# Altium schematic sheet ZW Radio.SchDoc
size A; SheetNumber: 6; SheetTotal: 6
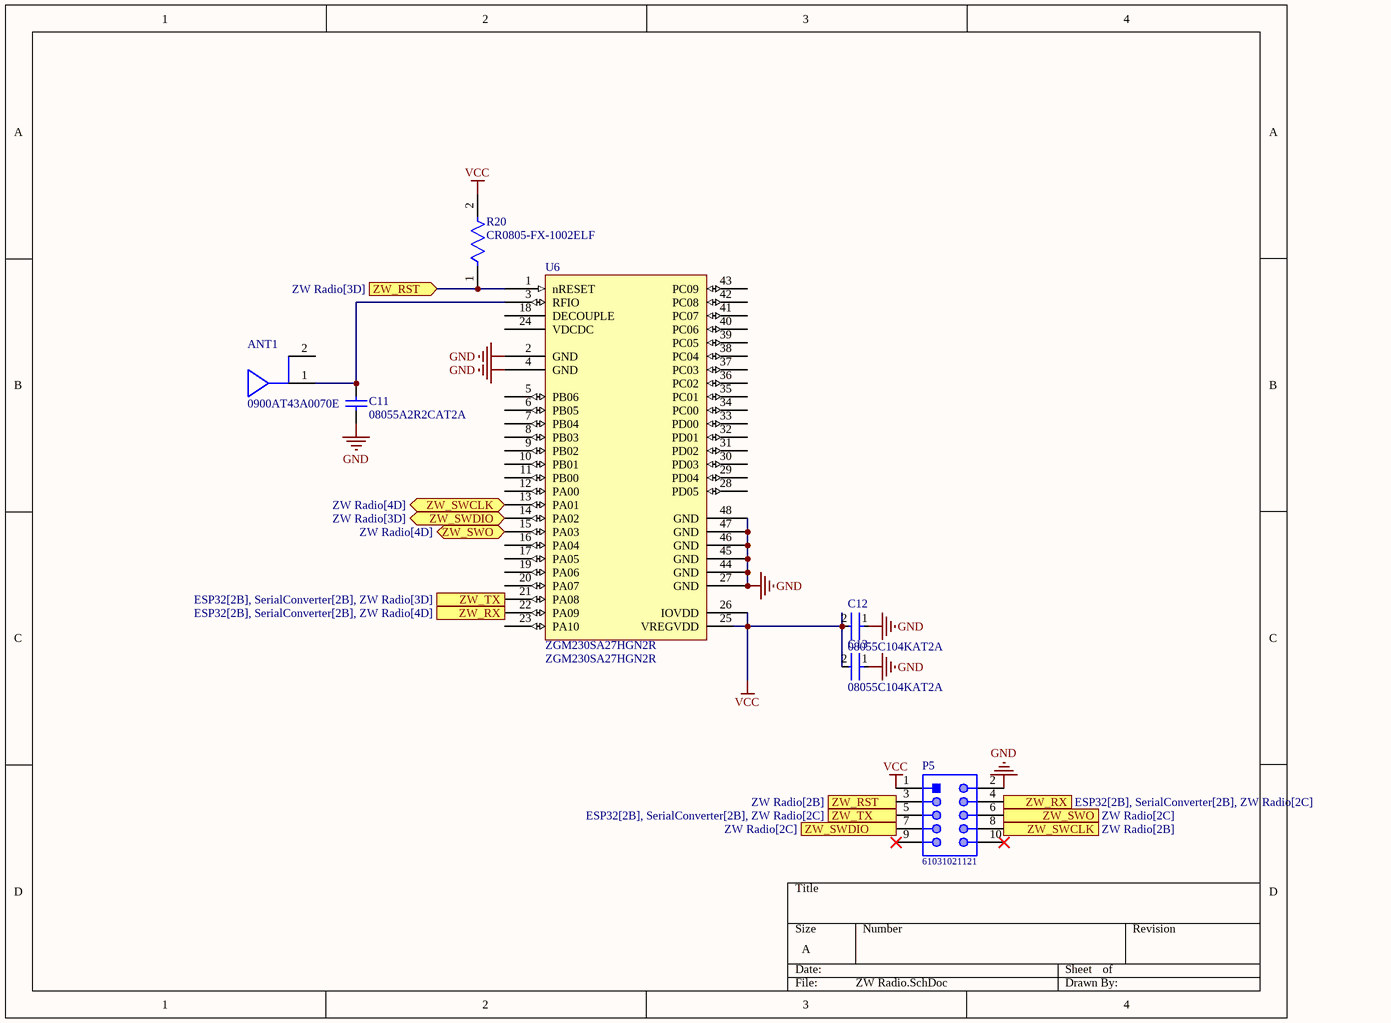
[diagram p0: ZW Radio.SchDoc]

## Parts
ANT1  0900AT43A0070E  [FP-0900AT43A0070E-MFG]
C11  08055A2R2CAT2A  [CAPC2013X94X50NL20T25]
C12  08055C104KAT2A  [FP-0805-L_2_01_0_2-W_1_25-IPC_C]
C13  08055C104KAT2A  [FP-0805-L_2_01_0_2-W_1_25-IPC_C]
P5  61031021121  [61031021121]
R20  CR0805-FX-1002ELF  [FP-CR0805-IPC_A]
U6  ZGM230SA27HGN2R  [QFN50P650X650X128_HS-45N]

## Ports
ZW_RST (in, see ZW Radio[2B]), ZW_RST (in, see ZW Radio[3D]), ZW_RX (in, see ESP32[2B], SerialConverter[2B], ZW Radio[4D]), ZW_RX (out, see ESP32[2B], SerialConverter[2B], ZW Radio[2C]), ZW_SWCLK (bidir, see ZW Radio[4D]), ZW_SWCLK (see ZW Radio[2B]), ZW_SWDIO (bidir, see ZW Radio[3D]), ZW_SWDIO (see ZW Radio[2C]), ZW_SWO (bidir, see ZW Radio[4D]), ZW_SWO (see ZW Radio[2C]), ZW_TX (in, see ESP32[2B], SerialConverter[2B], ZW Radio[2C]), ZW_TX (out, see ESP32[2B], SerialConverter[2B], ZW Radio[3D])

## Nets
GND: C11.1 C12.1 C13.1 P5.2 U6.2(GND) U6.4(GND) U6.27(GND) U6.44(GND) U6.45(GND) U6.46(GND) U6.47(GND) U6.48(GND)
VCC: C12.2 C13.2 P5.1 R20.2 U6.25(VREGVDD) U6.26(IOVDD)
ZW_RST: P5.3 R20.1 U6.1(nRESET) ; port ZW_RST
ZW_RX: P5.4 U6.22(PA09) ; port ZW_RX
ZW_SWCLK: P5.8 U6.13(PA01) ; port ZW_SWCLK
ZW_SWDIO: P5.7 U6.14(PA02) ; port ZW_SWDIO
ZW_SWO: P5.6 U6.15(PA03) ; port ZW_SWO
ZW_TX: P5.5 U6.21(PA08) ; port ZW_TX
NetANT1_1: ANT1.1(RF_Feeding_Point) C11.2 U6.3(RFIO)

Not connected (* = marked no-connect by the designer): ANT1 2(To_trace_element); P5 9* 10*; U6 5(PB06) 6(PB05) 7(PB04) 8(PB03) 9(PB02) 10(PB01) 11(PB00) 12(PA00) 16(PA04) 17(PA05) 18(DECOUPLE) 19(PA06) 20(PA07) 23(PA10) 24(VDCDC) 28(PD05) 29(PD04) 30(PD03) 31(PD02) 32(PD01) 33(PD00) 34(PC00) 35(PC01) 36(PC02) 37(PC03) 38(PC04) 39(PC05) 40(PC06) 41(PC07) 42(PC08) 43(PC09)

## Library data of the parts
ANT1 = CMP-56579-000002-1: RF ANT CHIP SOLDER SMD; Impedance: 50R; Max Frequency: 928MHz; Number of Pins: 2; Mount: Surface Mount; RoHS Compliant: No; Contact Plating: Tin
C11 = CMP-1036-00283-2: Manufacturer: AVX Interconnect / Elco; Part Number: 08055A2R2CAT2A
C12 C13 = CMP-2000-05016-2: General Purpose Ceramic Capacitor, 0805, 100nF, 10%, X7R, 0.15, 50V; Dissipation Factor: 2.5%; Insulation Resistance: 100GR; Voltage Rating (DC): 50V; Package Quantity: 4000; Tolerance: 10%; Voltage Rating: 50V; Dielectric: X7R; Case/Package: 0805; Lead Free: Lead Free; Dielectric Material: Ceramic; Thickness: 0.037inch; Weight: 0.001411oz; Max Operating Temperature: 125°C; REACH SVHC: No SVHC; Mount: Surface Mount; RoHS Compliant: Yes; Depth: 1.25mm; Height: 0.5mm; Case Code (Metric): 2012; Length: 2mm; Termination: Standard; Case Code (Imperial): 0805; Number of Pins: 2; Voltage: 50V; Radiation Hardening: No; Min Operating Temperature: -55°C; Capacitance: 100nF; Width: 1.2mm; Series: MLCC X7R; Packaging: Cut Tape
P5 = CMP-1502-01053-1: SMT Vertical Pin Header WR-PHD, Pitch 2.54 mm, Dual Row, 10 pins; Manufacturer: Wurth Elektronik; Gender: Male; Rated Current: 3A; Working Voltage: 250VAC; Withstanding Voltage: 500VAC; Pitch: 2.54mm; Pin Number: 10; Contact Resistance: 20mOhm; Packaging: TapeandReel; Part Number: 61031021121; Mounting Technology: SMT; Package Reference: 61031021121; Operating Temperature: -40to125degC; Manufacturer URL: http://www.we-online.de; Publisher: WurthElektronik; Datasheet URL: https://katalog.we-online.de/em/datasheet/6103xx21121.pdf; Orientation: Vertical; Row Number: Dual
R20 = CMP-07231-003204-1: Thick Film Chip Resistors 0805 10kΩ 0.125W 1% 100ppm/°C; Max Power Dissipation: 125mW; Voltage Rating: 150V; Voltage Rating (DC): 100V; Resistance: 10kR; Height: 0.5mm; Tolerance: 1%; Max Operating Temperature: 155°C; Thickness: 508um; Radiation Hardening: No; Packaging: Tape and Reel; Depth: 1.25mm; Contact Plating: Tin; Package Quantity: 1; Case Code (Metric): 2012; REACH SVHC: No SVHC; Min Operating Temperature: -55°C; Power Rating: 125mW; Mount: Surface Mount; Length: 2mm; Case Code (Imperial): 0805; Width: 1.25mm; Temperature Coefficient: 100ppm/°C; Termination: SMD/SMT; Composition: Thick Film; Features: Moisture Resistant; Case/Package: 0805; Number of Terminations: 2
U6 = CMP-021-00007-1: ZGM230S Z-wave Sip, Secure Vault; Power: 3.3W; Pins: 48; Case/Package: QFN-44